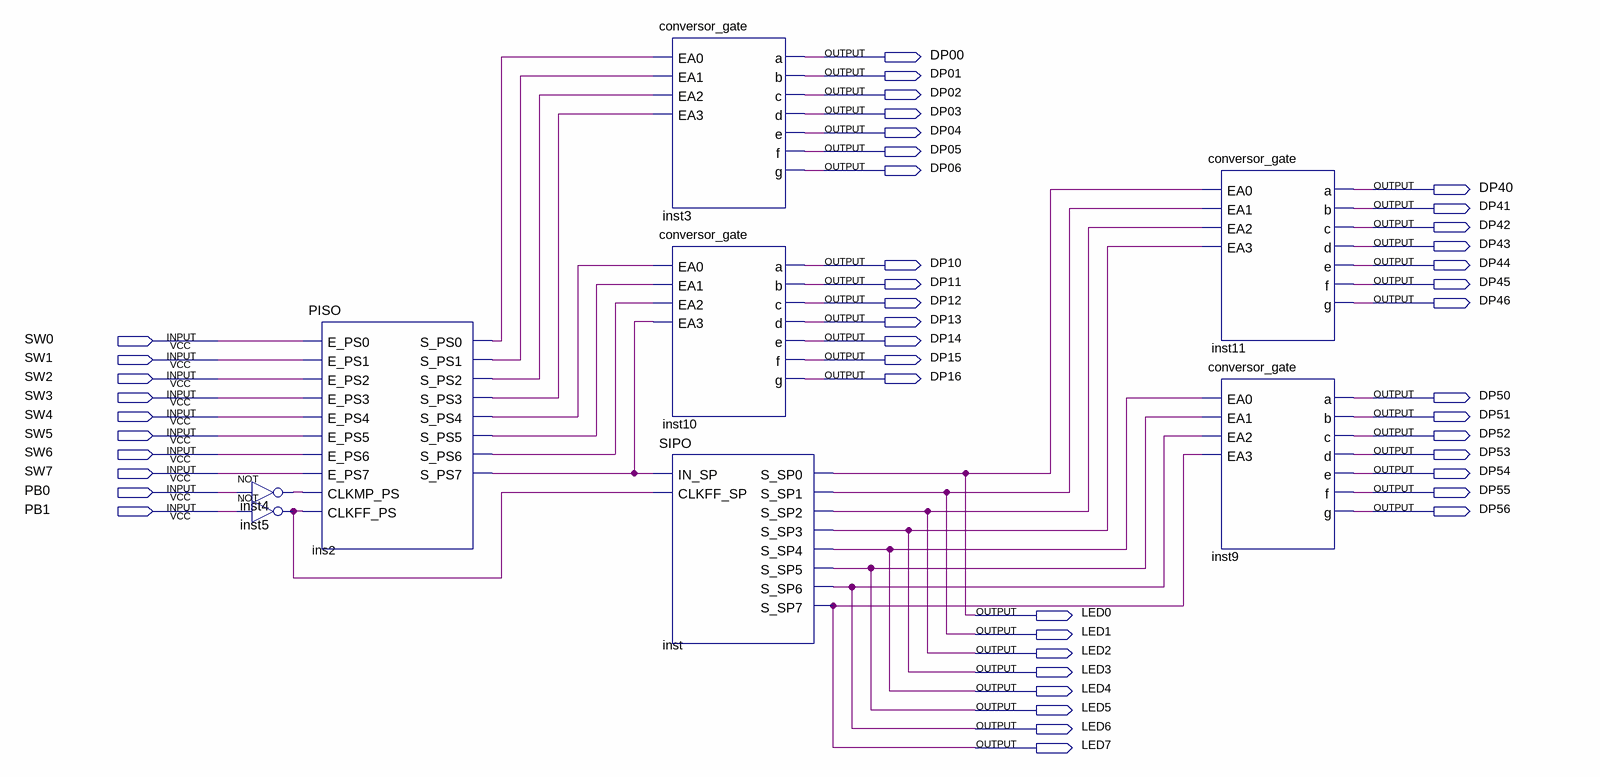
[diagram p0: schematic sheet]
// Quartus schematic SIPO_PISO.bdf as structural Verilog: 8 symbols, 46 pins
module SIPO_PISO (
  input  SW0,
  input  SW1,
  input  SW2,
  input  SW3,
  input  SW4,
  input  SW5,
  input  SW6,
  input  SW7,
  input  PB0,
  input  PB1,
  output DP00,
  output DP01,
  output DP02,
  output DP03,
  output DP04,
  output DP05,
  output DP06,
  output DP40,
  output DP41,
  output DP42,
  output DP43,
  output DP10,
  output DP44,
  output DP11,
  output DP45,
  output DP12,
  output DP46,
  output DP13,
  output DP14,
  output DP15,
  output DP16,
  output DP50,
  output DP51,
  output DP52,
  output DP53,
  output DP54,
  output DP55,
  output DP56,
  output LED0,
  output LED1,
  output LED2,
  output LED3,
  output LED4,
  output LED5,
  output LED6,
  output LED7
);

  wire ins2_s_ps0, ins2_s_ps1, ins2_s_ps2, ins2_s_ps3, ins2_s_ps4, ins2_s_ps5, ins2_s_ps6, ins2_s_ps7,
       inst4_out, inst5_out;

  not inst4 (inst4_out, PB0);
  not inst5 (inst5_out, PB1);
  PISO ins2 (
    .E_PS0(SW0), .E_PS1(SW1), .E_PS2(SW2), .E_PS3(SW3), .E_PS4(SW4), .E_PS5(SW5), .E_PS6(SW6), .E_PS7(SW7),
    .CLKMP_PS(inst4_out), .CLKFF_PS(inst5_out), .S_PS0(ins2_s_ps0), .S_PS1(ins2_s_ps1), .S_PS2(ins2_s_ps2),
    .S_PS3(ins2_s_ps3), .S_PS4(ins2_s_ps4), .S_PS5(ins2_s_ps5), .S_PS6(ins2_s_ps6), .S_PS7(ins2_s_ps7));
  conversor_gate inst3 (
    .EA0(ins2_s_ps0), .EA1(ins2_s_ps1), .EA2(ins2_s_ps2), .EA3(ins2_s_ps3), .a(DP00), .b(DP01), .c(DP02),
    .d(DP03), .e(DP04), .f(DP05), .g(DP06));
  conversor_gate inst10 (
    .EA0(ins2_s_ps4), .EA1(ins2_s_ps5), .EA2(ins2_s_ps6), .EA3(ins2_s_ps7), .a(DP10), .b(DP11), .c(DP12),
    .d(DP13), .e(DP14), .f(DP15), .g(DP16));
  SIPO inst (
    .IN_SP(ins2_s_ps7), .CLKFF_SP(inst5_out), .S_SP0(LED0), .S_SP1(LED1), .S_SP2(LED2), .S_SP3(LED3),
    .S_SP4(LED4), .S_SP5(LED5), .S_SP6(LED6), .S_SP7(LED7));
  conversor_gate inst11 (
    .EA0(LED0), .EA1(LED1), .EA2(LED2), .EA3(LED3), .a(DP40), .b(DP41), .c(DP42), .d(DP43), .e(DP44),
    .f(DP45), .g(DP46));
  conversor_gate inst9 (
    .EA0(LED4), .EA1(LED5), .EA2(LED6), .EA3(LED7), .a(DP50), .b(DP51), .c(DP52), .d(DP53), .e(DP54),
    .f(DP55), .g(DP56));
endmodule
